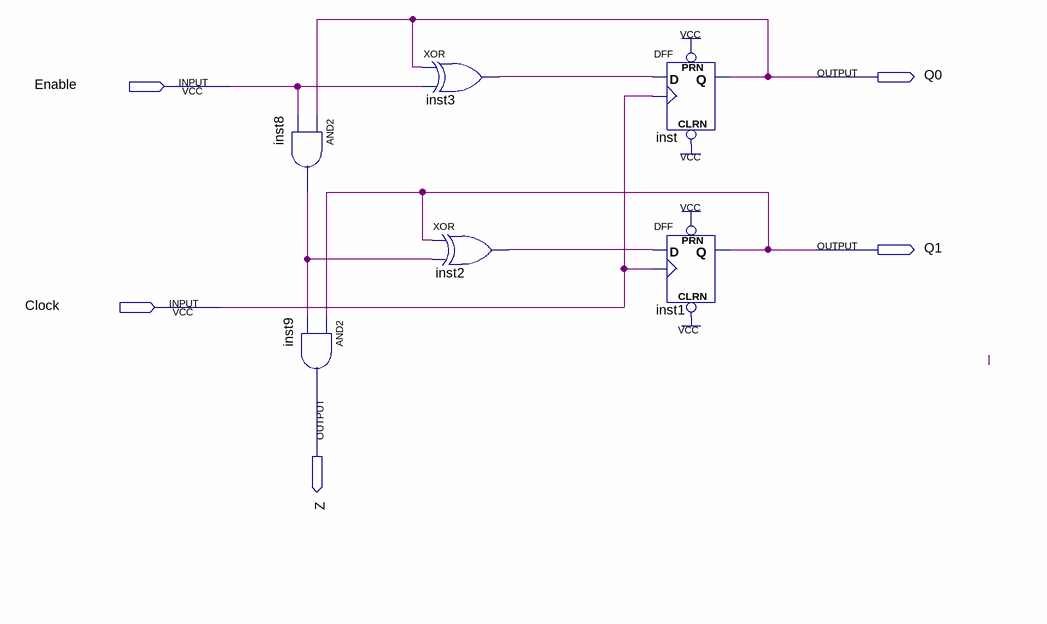
[diagram p0: schematic sheet]
// Quartus schematic 2-bitCounter.bdf as structural Verilog: 6 symbols, 5 pins
module \2-bitCounter  (
  input  Enable,
  input  Clock,
  output Q0,
  output Q1,
  output Z
);

  wire inst2_out, inst3_out, inst8_out;

  and inst8 (inst8_out, Q0, Enable);
  and inst9 (Z, Q1, inst8_out);
  xor inst3 (inst3_out, Q0, Enable);
  xor inst2 (inst2_out, Q1, inst8_out);
  DFF inst (.CLRN(1'b1), .CLK(Clock), .D(inst3_out), .PRN(1'b1), .Q(Q0));
  DFF inst1 (.CLRN(1'b1), .CLK(Clock), .D(inst2_out), .PRN(1'b1), .Q(Q1));
endmodule
